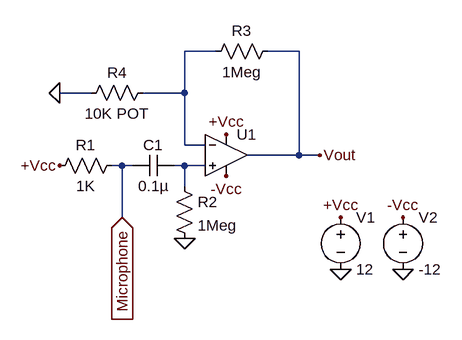
[diagram p0: schematic microphone_driver.asc]
microphone_driver.asc, the LTspice schematic file:
Version 4
SHEET 1 880 680
WIRE 256 -32 208 -32
WIRE 384 -32 336 -32
WIRE 64 32 16 32
WIRE 208 32 208 -32
WIRE 208 32 144 32
WIRE 208 112 208 32
WIRE 240 112 208 112
WIRE 384 128 384 -32
WIRE 384 128 304 128
WIRE 416 128 384 128
WIRE 112 144 96 144
WIRE 128 144 112 144
WIRE 208 144 192 144
WIRE 240 144 208 144
WIRE 208 176 208 144
WIRE 112 224 112 144
FLAG 208 256 0
FLAG 448 304 0
FLAG 544 304 0
FLAG 16 32 0
FLAG 112 224 Microphone
IOPIN 112 224 In
FLAG 416 128 Vout
FLAG 448 224 +Vcc
FLAG 16 144 +Vcc
FLAG 272 96 +Vcc
FLAG 544 224 -Vcc
FLAG 272 160 -Vcc
SYMBOL res 112 128 R90
WINDOW 0 0 56 VBottom 2
WINDOW 3 32 56 VTop 2
SYMATTR InstName R1
SYMATTR Value 1K
SYMBOL cap 192 128 R90
WINDOW 0 0 32 VBottom 2
WINDOW 3 32 32 VTop 2
SYMATTR InstName C1
SYMATTR Value 0.1µ
SYMBOL OpAmps\\UniversalOpAmp2 272 128 R0
SYMATTR InstName U1
SYMBOL res 192 160 R0
SYMATTR InstName R2
SYMATTR Value 1Meg
SYMBOL res 352 -48 R90
WINDOW 0 0 56 VBottom 2
WINDOW 3 32 56 VTop 2
SYMATTR InstName R3
SYMATTR Value 1Meg
SYMBOL voltage 448 208 R0
WINDOW 123 0 0 Left 0
WINDOW 39 0 0 Left 0
SYMATTR InstName V1
SYMATTR Value 12
SYMBOL voltage 544 208 R0
WINDOW 123 0 0 Left 0
WINDOW 39 0 0 Left 0
SYMATTR InstName V2
SYMATTR Value -12
SYMBOL res 160 16 R90
WINDOW 0 0 56 VBottom 2
WINDOW 3 32 56 VTop 2
SYMATTR InstName R4
SYMATTR Value 10K POT

The netlist it stands for:
* microphone_driver.asc
R1 Microphone +Vcc 1K
C1 N002 Microphone 0.1µ
XU1 N002 N001 +Vcc -Vcc Vout level2 Avol=1Meg GBW=10Meg Slew=10Meg Ilimit=25m Rail=0 Vos=0 En=0 Enk=0 In=0 Ink=0 Rin=500Meg  ; pins In+ In- V+ V- OUT
R2 N002 0 1Meg
R3 Vout N001 1Meg
V1 +Vcc 0 12
V2 -Vcc 0 -12
R4 N001 0 10K POT
.lib UniversalOpAmp2.lib
.backanno
.end